# EAGLE design BATT_INPUT_REVISION (EAGLE 9.6.2)
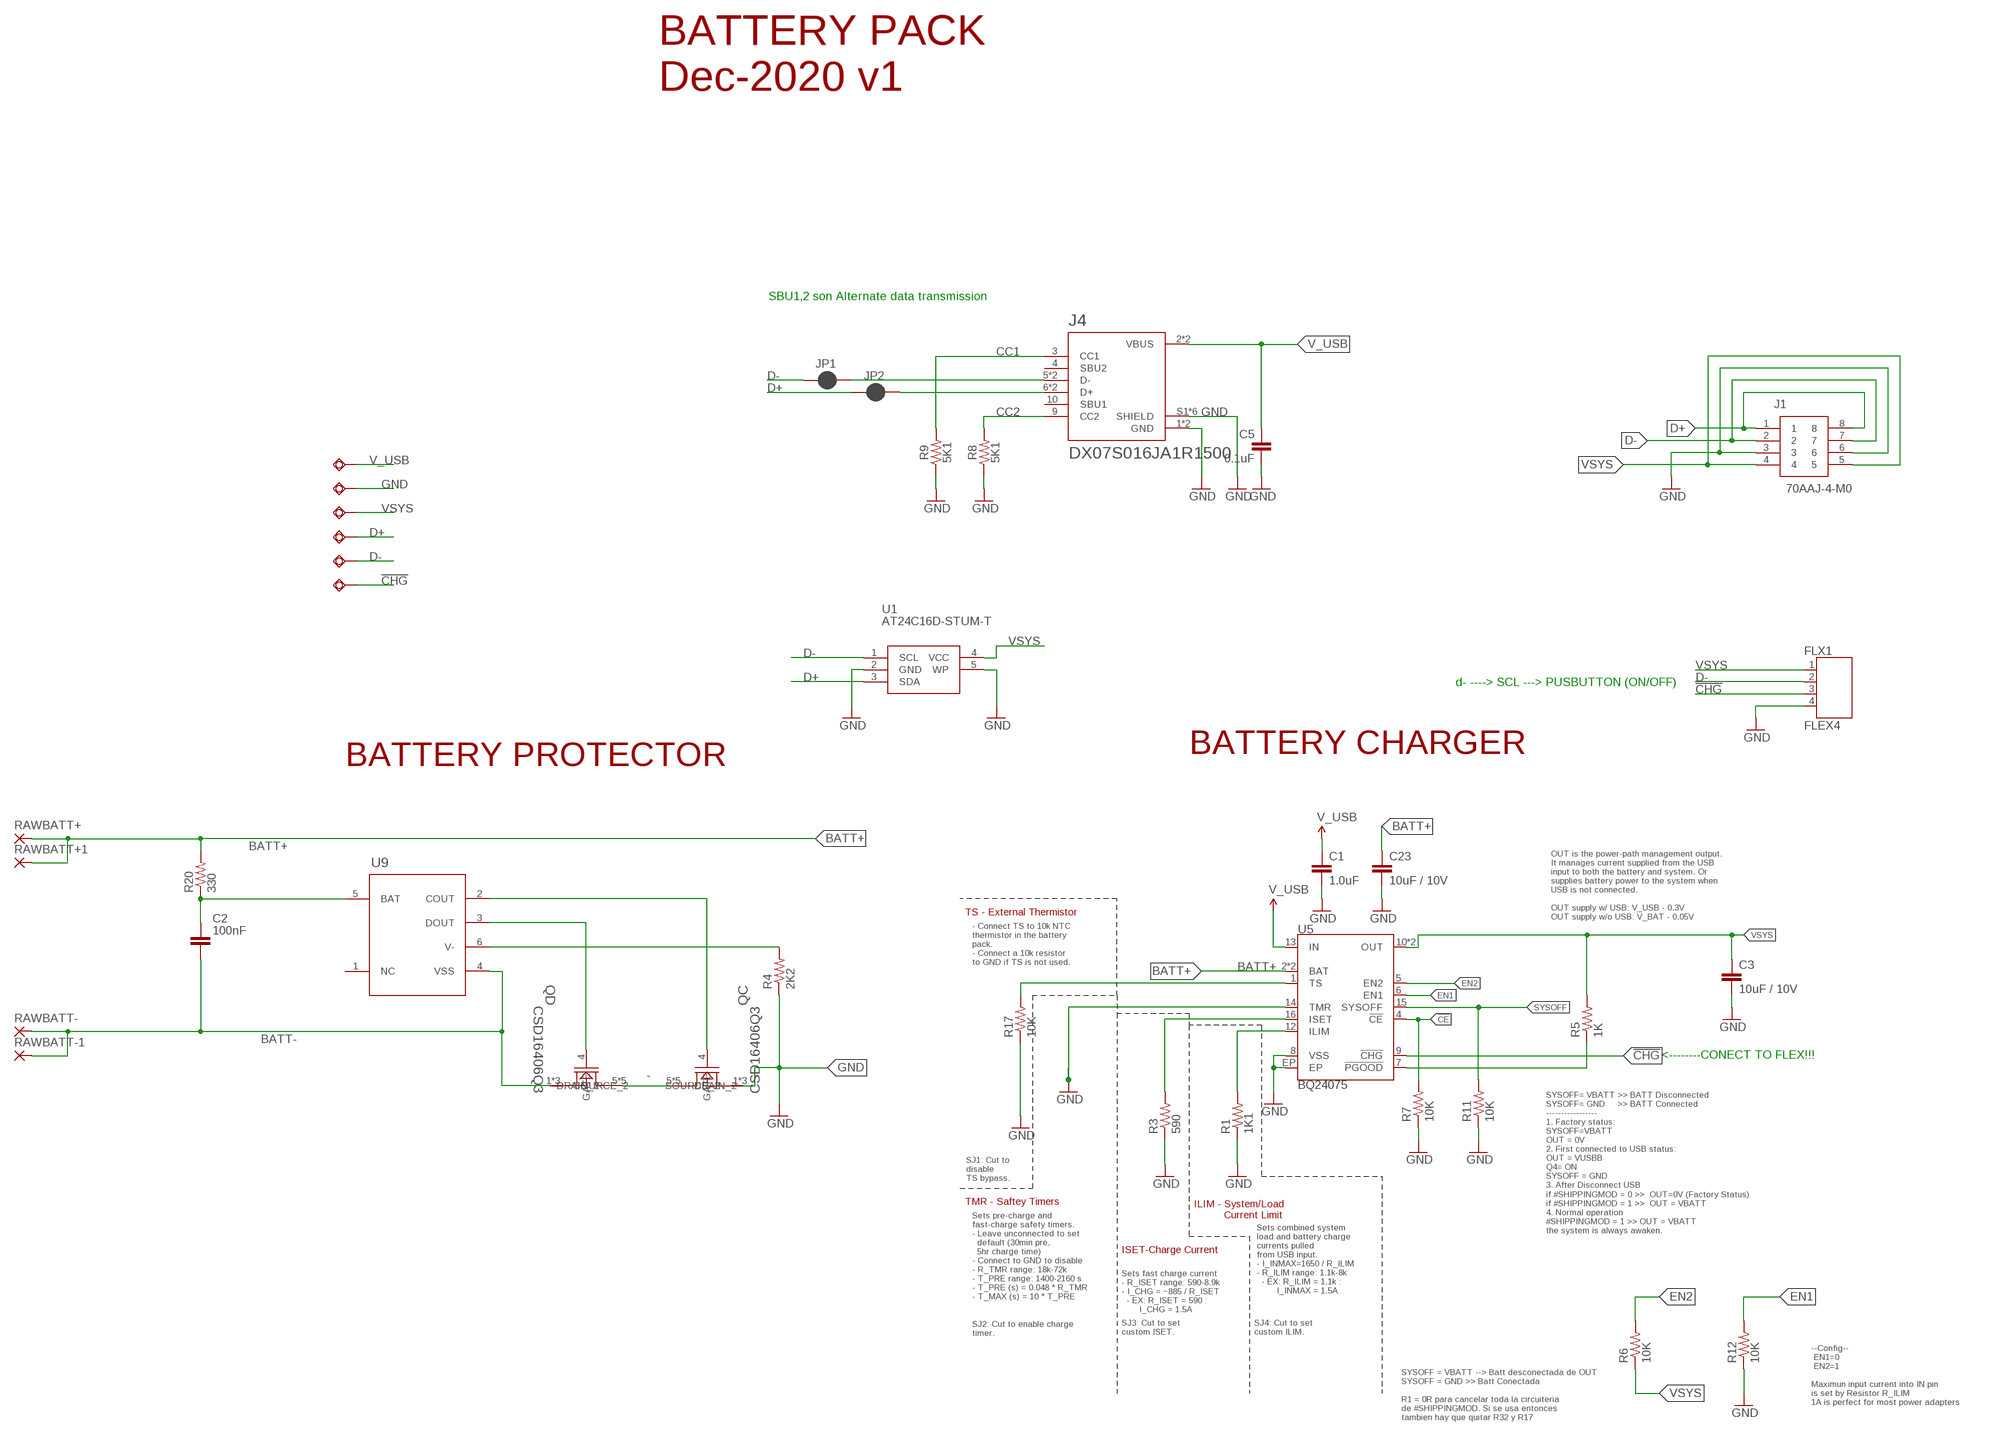
[diagram p0: schematic, sheet 1]

## Parts
!CHG!  TESTPAD_TPSQB1,27  [TESTPAD_B1,27]
C1  1.0uF  1.0UF-0603-16V-10%  [0603]
C2  100nF  C_CHIP-0603(1608-METRIC)  [CAPC1608X85]
C3  10uF / 10V  10UF10V10%(0805)  [0805-CAP]
C5  0.1uF  0.1UF-0603-25V-(+80/-20%)  [0603]
C23  10uF / 10V  10UF10V10%(0805)  [0805-CAP]
D+  TESTPAD_TPSQB1,27  [TESTPAD_B1,27]
D-  TESTPAD_TPSQB1,27  [TESTPAD_B1,27]
FLX1  FLEX4  [FLEX4]
GND  TESTPAD_TPSQB1,27  [TESTPAD_B1,27]
J1  70AAJ-4-M0  [70AAJ4M0]
J4  DX07S016JA1R1500  [JAE_DX07S016JA1R1500]
JP1  JUMPER-SMT_2_NC_PASTE_SILK  [SMT-JUMPER_2_NC_PASTE_SILK]
JP2  JUMPER-SMT_2_NC_PASTE_SILK  [SMT-JUMPER_2_NC_PASTE_SILK]
QC  CSD16406Q3  [DQG0008A]
QD  CSD16406Q3  [DQG0008A]
R1  1K1  RESISTOR0402  [0402]
R3  590  RESISTOR0402  [0402]
R4  2K2  RESISTOR0402  [0402]
R5  1K  RESISTOR0402  [0402]
R6  10K  RESISTOR0402  [0402]
R7  10K  RESISTOR0402  [0402]
R8  5K1  RESISTOR0402  [0402]
R9  5K1  RESISTOR0402  [0402]
R11  10K  RESISTOR0402  [0402]
R12  10K  RESISTOR0402  [0402]
R17  10K  RESISTOR0402  [0402]
R20  330  RESISTOR0402  [0402]
RAWBATT+  SMD5  [SMD2,54-5,08]
RAWBATT+1  SMD5  [SMD2,54-5,08]
RAWBATT-  SMD5  [SMD2,54-5,08]
RAWBATT-1  SMD5  [SMD2,54-5,08]
U1  AT24C16D-STUM-T  [SOT95P280X100-5N]
U5  BQ24075  [PVQFN-N16]
U9  Value  BQ29700DSER  [DSE0006A]
V_USB  TESTPAD_TPSQB1,27  [TESTPAD_B1,27]
VSYS  TESTPAD_TPSQB1,27  [TESTPAD_B1,27]

## Nets
!CE!: R7.2 U5.4(!CE!)
!CHG!: !CHG!.TP FLX1.3 U5.9(!CHG!)
-: QC.5(DRAIN_2) QC.6(DRAIN_2) QC.7(DRAIN_2) QC.8(DRAIN_2) QC.9(DRAIN_2) QD.5(DRAIN_2) QD.6(DRAIN_2) QD.7(DRAIN_2) QD.8(DRAIN_2) QD.9(DRAIN_2)
BATT+: C23.1 R20.2 RAWBATT+1.1(P) RAWBATT+.1(P) U5.2(BAT) U5.3(BAT)
BATT-: C2.2 QD.1(SOURCE_2) QD.2(SOURCE_2) QD.3(SOURCE_2) RAWBATT-1.1(P) RAWBATT-.1(P) U9.4(VSS)
CC1: J4.3(CC1) R9.2
CC2: J4.9(CC2) R8.2
D+: D+.TP J1.1 J1.8 JP2.1 U1.3(SDA)
D-: D-.TP FLX1.2 J1.2 J1.7 JP1.1 U1.1(SCL)
EN1: R12.2 U5.6(EN1)
EN2: R6.2 U5.5(EN2)
GND: C1.2 C3.2 C5.2 C23.2 FLX1.4 GND.TP J1.3 J1.6 J4.1(GND) J4.12(GND) J4.S1(SHIELD) J4.S2(SHIELD) J4.S3(SHIELD) J4.S4(SHIELD) J4.S5(SHIELD) J4.S6(SHIELD) QC.1(SOURCE_2) QC.2(SOURCE_2) QC.3(SOURCE_2) R1.1 R3.1 R4.1 R7.1 R8.1 R9.1 R11.1 R12.1 R17.1 U1.2(GND) U1.5(WP) U5.8(VSS) U5.14(TMR) U5.EP
ILIM: R1.2 U5.12(ILIM)
ISET: R3.2 U5.16(ISET)
N$1: R5.1 U5.7(!PGOOD!)
N$2: J4.5(D-) J4.8(D-) JP1.2
N$3: J4.6(D+) J4.7(D+) JP2.2
N$12: C2.1 R20.1 U9.5(BAT)
N$20: R4.2 U9.6(V-)
N$25: QC.4(GATE) U9.2(COUT)
N$26: QD.4(GATE) U9.3(DOUT)
SYSOFF: R11.2 U5.15(SYSOFF)
TS1: R17.2 U5.1(TS)
V_USB: C1.1 C5.1 J4.2(VBUS) J4.11(VBUS) U5.13(IN) V_USB.TP
VSYS: C3.1 FLX1.1 J1.4 J1.5 R5.2 R6.1 U1.4(VCC) U5.10(OUT) U5.11(OUT) VSYS.TP
Unconnected: J4.4(SBU2) J4.10(SBU1) U9.1(NC)

## Notes on the sheet
- BATTERY PACK
  Dec-2020 v1
- SBU1,2 son Alternate data transmission
- d- ----> SCL ---> PUSBUTTON (ON/OFF)
- BATTERY CHARGER
- BATTERY PROTECTOR
- OUT is the power-path management output.
  It manages current supplied from the USB 
  input to both the battery and system. Or
  supplies battery power to the system when 
  USB is not connected.
  
  OUT supply w/ USB: V_USB - 0.3V
  OUT supply w/o USB: V_BAT - 0.05V
- TS - External Thermistor
- - Connect TS to 10k NTC 
  thermistor in the battery
  pack.
  - Connect a 10k resistor 
  to GND if TS is not used.
- <--------CONECT TO FLEX!!!
- SYSOFF= VBATT >> BATT Disconnected
  SYSOFF= GND     >> BATT Connected
  -----------------
  1. Factory status:
  SYSOFF=VBATT
  OUT = 0V
  2. First connected to USB status:
  OUT = VUSBB
  Q4= ON
  SYSOFF = GND
  3. After Disconnect USB
  if #SHIPPINGMOD = 0 >>  OUT=0V (Factory Status)
  if #SHIPPINGMOD = 1 >>  OUT = VBATT
  4. Normal operation
  #SHIPPINGMOD = 1 >> OUT = VBATT 
  the system is always awaken.
- SJ1: Cut to 
  disable
  TS bypass.
- TMR - Saftey Timers
- ILIM - System/Load 
            Current Limit
- Sets pre-charge and
  fast-charge safety timers.
  - Leave unconnected to set
    default (30min pre, 
    5hr charge time)
  - Connect to GND to disable
  - R_TMR range: 18k-72k
  - T_PRE range: 1400-2160 s
  - T_PRE (s) = 0.048 * R_TMR
  - T_MAX (s) = 10 * T_PRE
- Sets combined system
  load and battery charge 
  currents pulled
  from USB input.
  - I_INMAX=1650 / R_ILIM
  - R_ILIM range: 1.1k-8k
    - EX: R_ILIM = 1.1k : 
          I_INMAX = 1.5A
- ISET-Charge Current
- Sets fast charge current
  - R_ISET range: 590-8.9k
  - I_CHG = ~885 / R_ISET
    - EX: R_ISET = 590 : 
         I_CHG = 1.5A
- SJ3: Cut to set
  custom ISET.
- SJ4: Cut to set
  custom ILIM.
- SJ2: Cut to enable charge
  timer.
- --Config--
   EN1=0 
   EN2=1
  
  Maximun input current into IN pin
  is set by Resistor R_ILIM
  1A is perfect for most power adapters
- SYSOFF = VBATT --> Batt desconectada de OUT
  SYSOFF = GND >> Batt Conectada
  
  R1 = 0R para cancelar toda la circuiteria
  de #SHIPPINGMOD. Si se usa entonces
  tambien hay que quitar R32 y R17

## Library data of the parts
!CHG! D+ D- GND V_USB VSYS = BeagleBone_Blue_R3:TESTPAD_TPSQ: Test pad
C1 = SparkFun-Capacitors:1.0UF: 1µF ceramic capacitors A capacitor is a passive two-terminal electrical component used to store electrical energy temporarily in an electric field.; PROD_ID: CAP-00868
C2 = Tutorial - Fusion 360:C: Capacitor - Generic; CATEGORY: Capacitor
C3 C23 = SparkFun-Capacitors:10UF10V10%(0805): CAP-11330; PROD_ID: CAP-11330
C5 = SparkFun-Capacitors:0.1UF: 0.1µF ceramic capacitors A capacitor is a passive two-terminal electrical component used to store electrical energy temporarily in an electric field.; PROD_ID: CAP-00810
FLX1 = Flex4:FLEX4
J1 = ANTENNA:70AAJ-4-M0: Bourns Male 4 Way Modular Contact, Surface Mount, 3A, 60 V Source: Datasheet <https://componentsearchengine.com/Datasheets/1/70AAJ-4-M0.pdf>; DESCRIPTION: Bourns Male 4 Way Modular Contact, Surface Mount, 3A, 60 V; HEIGHT: 3.81mm; MANUFACTURER_NAME: Bourns; MANUFACTURER_PART_NUMBER: 70AAJ-4-M0; MOUSER_PART_NUMBER: 652-70AAJ-4-M0; MOUSER_PRICE-STOCK: https://www.mouser.com/Search/Refine.aspx?Keyword=652-70AAJ-4-M0
J4 = DX07S016JA1R1500:DX07S016JA1R1500: USB-C (USB TYPE-C) USB 2.0 Receptacle Connector 24 (16+8 Dummy) Position Surface Mount, Right Angle; Through Hole; DESCRIPTION: USB-C (USB TYPE-C) USB 2.0 Receptacle Connector 24 (16+8 Dummy) Position Surface Mount, Right Angle; Through Hole; DIGI-KEY_PART_NUMBER: 670-DX07S016JA1R1500CT-ND; MF: JAE Electronics; MP: DX07S016JA1R1500; PACKAGE: None; PURCHASE-URL: https://pricing.snapeda.com/search/part/DX07S016JA1R1500/?ref=eda
JP1 JP2 = SparkFun-Jumpers:JUMPER-SMT_2_NC_PASTE: Normally closed solder jumper This jumper has an aperture in the stencil to allow solder paste to bridge the split in the wire so it's normally closed (NC). Wick off the solder to open the connection. Reapply solder to reclose the connection.
QC QD = CSD16406Q3:CSD16406Q3; DATASHEET_URL: http://www.ti.com/lit/ds/symlink/csd16406q3.pdf; IDSMAX: 60.0; MANUFACTURER_PART_NUMBER: CSD16406Q3; QGTYP: 5.8; QUANTITY: 1; RDSON45: 0.0059; VDSMAX: 25.0; VENDOR: Texas Instruments
R1 R3-R9 R11 R12 R17 R20 = SparkFun-Resistors:RESISTOR: Generic Resistor Package
RAWBATT+ RAWBATT+1 RAWBATT- RAWBATT-1 = wirepad:SMD5: SMD PAD
U1 = AT24C16D-STUM-T:AT24C16D-STUM-T: EEPROM Serial-2Wire 16K-bit 2K x 8 1.8V/2.5V/3.3V 5-Pin SOT-23 T/R Source: Datasheet <https://www.arrow.com/en/products/at24c16d-stum-t/microchip-technology>; ARROW_PART_NUMBER: AT24C16D-STUM-T; ARROW_PRICE-STOCK: https://www.arrow.com/en/products/at24c16d-stum-t/microchip-technology; DESCRIPTION: EEPROM Serial-2Wire 16K-bit 2K x 8 1.8V/2.5V/3.3V 5-Pin SOT-23 T/R; HEIGHT: 1mm; MANUFACTURER_NAME: Microchip; MANUFACTURER_PART_NUMBER: AT24C16D-STUM-T; MOUSER_PART_NUMBER: 556-AT24C16D-STUM-T; MOUSER_PRICE-STOCK: https://www.mouser.co.uk/ProductDetail/Microchip-Technology-Atmel/AT24C16D-STUM-T?qs=YAvGbpKWXiSFXLERVL65hQ%3D%3D
U5 = battery-management-temp:BQ24075; PROD_ID: IC-13219
U9 = BQ2970:BQ29700DSER; MANUFACTURER: Texas Instruments; PARTNUMBER: BQ29705DSER; REFDES: RefDes; TYPE: TYPE

## Net classes
1 power: width 0.178 mm
2 gnd: width 0.305 mm, drill 0.483 mm, clearance 0.203 mm

## Board
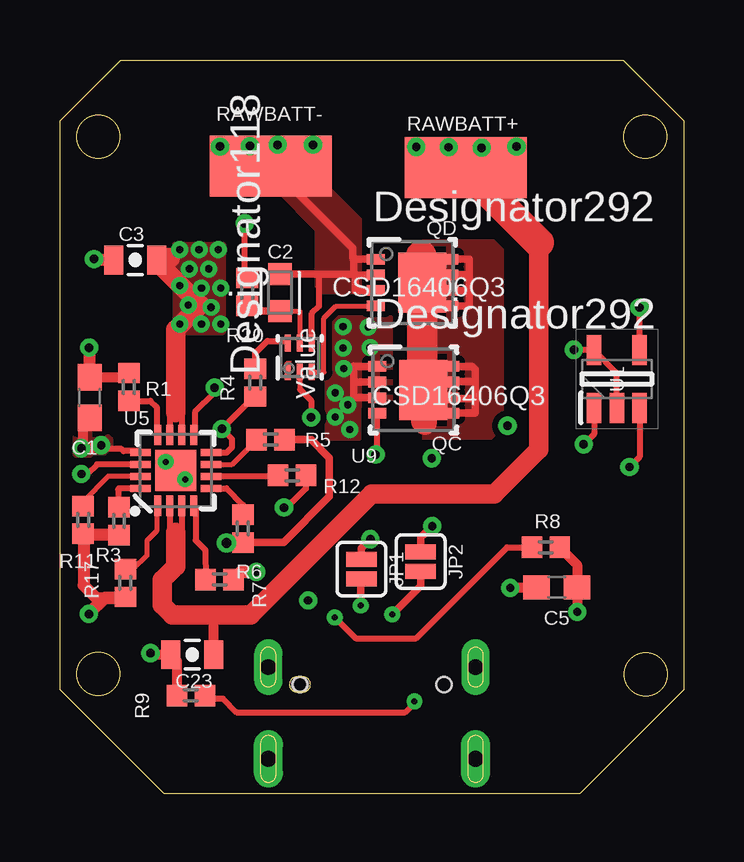
[diagram p1: board, top side]
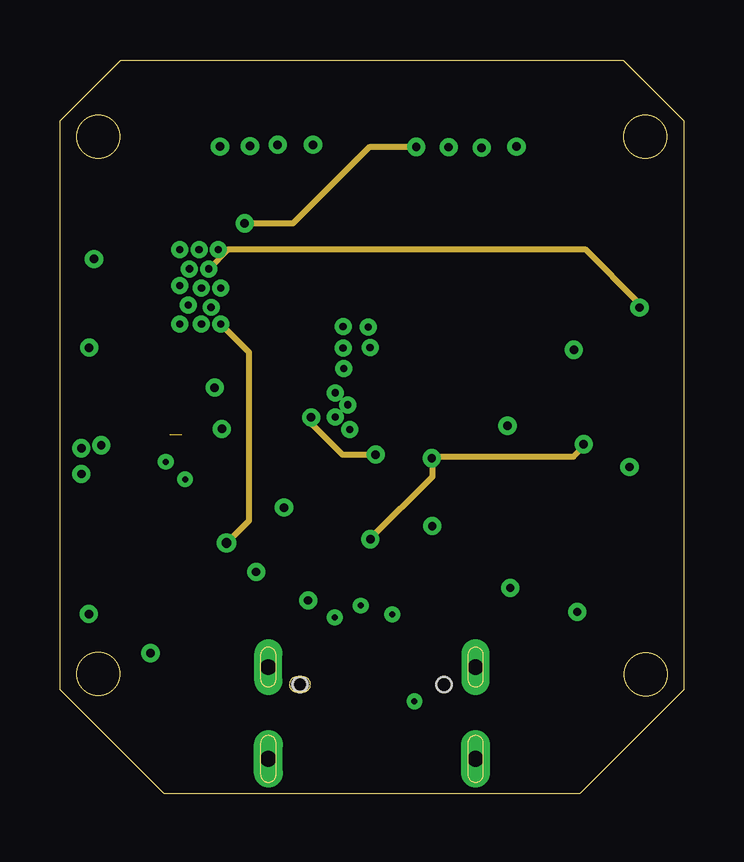
[diagram p2: board, inner layer Route2]
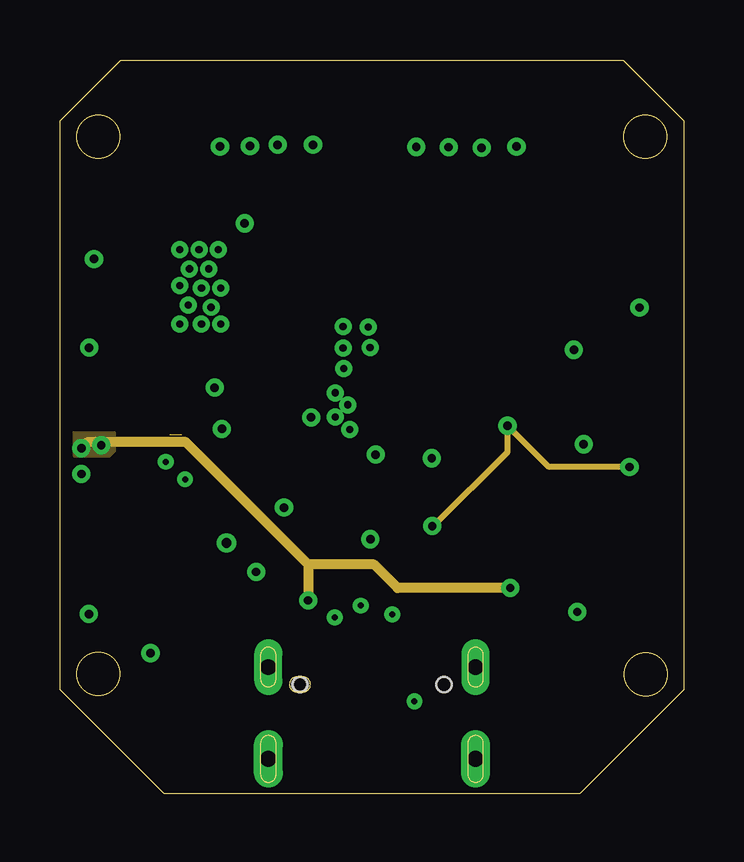
[diagram p3: board, inner layer Route15]
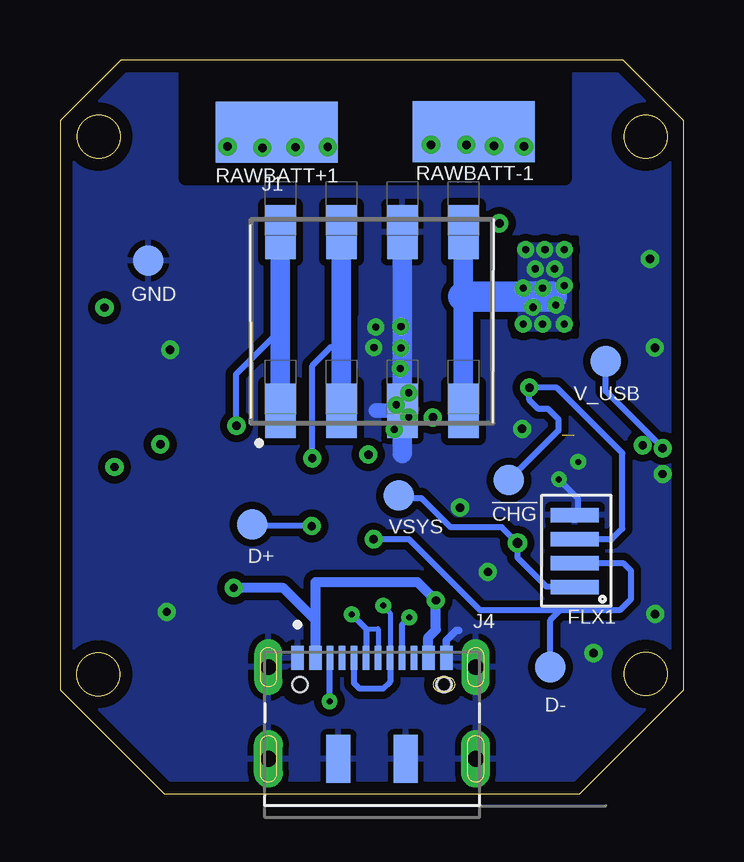
[diagram p4: board, bottom side, seen from below]

Size 26 x 30.6 mm. Coordinates in mm from the lower left corner, seen from the top.
Outline: 26,4.35 21.65,0 4.35,0 0,4.35 0,28.06 2.54,30.6 23.46,30.6 26,28.06 26,4.35
Outline: circle at 1.6,5 radius 0.9
Outline: circle at 1.59,27.41 radius 0.9
Outline: circle at 24.39,27.41 radius 0.9
Outline: circle at 24.4,4.99 radius 0.9
Copper layers (1+2*15+16): Top 0.035mm / dielectric 1.5mm / Route2 0.035mm / dielectric 0.15mm / Route15 0.035mm / dielectric 0.2mm / Bottom 0.035mm
Design rules "default *": minimum track width 6mil, minimum drill 0.2mm, track to track 10mil, track to pad 10mil, pad to pad 10mil, via to via 10mil, smd to smd 6mil, copper to edge 20mil, drill to drill 6mil, minimum pad ring 10mil, minimum via ring 8mil, stop-mask expansion 4mil, vias tented up to drill 0mil, thermal gap 10mil
bRestrict: area 5,25.7 to 20.8,30.3

### Footprints (pad centres in the part's own frame; a part is rotated, then mirrored left to right if it is on the bottom)
TESTPAD_B1,27 = smd 1.27 x 1.27: TP 0,0
0603 = smd 1.1 x 1: 1 -0.85,0; 2 0.85,0
CAPC1608X85 = smd 0.921 x 0.97: 1 -0.775,0; 2 0.775,0
0805-CAP = smd 0.8 x 1.2: 1 -0.9,0; 2 0.9,0
FLEX4 = smd 0.6 x 2: 1 -3.77,1.52; 2 -2.77,1.52; 3 -1.77,1.52; 4 -0.77,1.52
70AAJ4M0 = smd 1.27 x 2.26: 1 -3.81,-3.72; 2 -1.27,-3.72; 3 1.27,-3.72; 4 3.81,-3.72; 5 3.81,3.72; 6 1.27,3.72; 7 -1.27,3.72; 8 -3.81,3.72
JAE_DX07S016JA1R1500 = smd 0.52 x 1: 1 -3.1,1.1; 2 -2.35,1.1; 11 2.35,1.1; 12 3.1,1.1 | smd 0.27 x 1: 3 -1.75,1.1; 4 -1.25,1.1; 5 -0.75,1.1; 6 -0.25,1.1; 7 0.25,1.1; 8 0.75,1.1; 9 1.25,1.1; 10 1.75,1.1 | smd 1 x 2: S1 -1.4,-3.1; S2 1.4,-3.1 | drill 0.65 long: S3 -4.32,0.725; S4 4.32,0.725 | drill 0.65 pad 1.2 long: S5 -4.32,-3.1; S6 4.32,-3.1 | hole 0.6: 3,0 | hole 0.63: 3,0; -3,0
SMT-JUMPER_2_NC_PASTE_SILK = smd 0.635 x 1.27: 1 -0.406,0; 2 0.406,0
DQG0008A = smd 0.75 x 0.44: 1 -1.525,0.975; 2 -1.525,0.325; 3 -1.525,-0.325; 4 -1.525,-0.975; 5 1.525,-0.975; 6 1.525,-0.325; 7 1.525,0.325; 8 1.525,0.975 | smd 2 x 2.5: 9 0.4,0 | smd 0.5 x 0.5: V 0.226,0.975
0402 = smd 0.85 x 0.9: 1 -0.58,0; 2 0.58,0
SMD2,54-5,08 = smd 2.54 x 5.08: 1 0,0
SOT95P280X100-5N = smd 1.25 x 0.6: 1 -1.2,0.95; 2 -1.2,0; 3 -1.2,-0.95; 4 1.2,-0.95; 5 1.2,0.95
PVQFN-N16 = smd 0.28 x 0.85: 1 -0.75,-1.475; 2 -0.25,-1.475; 3 0.25,-1.475; 4 0.75,-1.475; 9 0.75,1.475; 10 0.25,1.475; 11 -0.25,1.475; 12 -0.75,1.475 | smd 0.85 x 0.28: 5 1.475,-0.75; 6 1.475,-0.25; 7 1.475,0.25; 8 1.475,0.75; 13 -1.475,0.75; 14 -1.475,0.25; 15 -1.475,-0.25; 16 -1.475,-0.75 | smd 1.7 x 1.7: EP 0,0
DSE0006A = smd 0.66 x 0.25: 1 -0.62,0.5 | smd 0.7 x 0.25: 2 -0.6,0; 3 -0.6,-0.5; 4 0.6,-0.5; 5 0.6,0; 6 0.6,0.5

### Placement (x,y rotation side)
!CHG!  7.29,13.09 0 bottom
C1  1.23,16.53 90 top
C2  9.16,20.9 90 top
C3  3.13,22.26 180 top
C5  20.7,8.61 0 top
C23  5.51,5.81 180 top
D+  17.99,11.24 0 bottom
D-  5.57,5.29 0 bottom
FLX1  3.03,12.4 90 bottom
GND  22.32,22.24 0 bottom
J1  13,19.7 0 bottom
J4  13,4.56 0 bottom
JP1  12.56,9.37 270 top
JP2  15.03,9.69 270 top
QC  14.73,16.85 0 top
QD  14.68,21.32 0 top
R1  2.87,16.97 270 top
R3  2.46,11.37 90 top
R4  8.13,17.15 90 top
R5  8.77,14.77 0 top
R6  7.62,11.06 90 top
R7  6.65,8.94 180 top
R8  20.24,10.28 180 top
R9  5.45,4.11 0 top
R11  0.96,11.42 90 top
R12  9.67,13.28 180 top
R17  2.73,8.79 90 top
R20  7.8,20.93 90 top
RAWBATT+  16.9,26.11 90 top
RAWBATT+1  16.97,27.59 270 bottom
RAWBATT-  8.77,26.17 90 top
RAWBATT-1  8.77,27.61 270 bottom
U1  23.2,17.3 90 top
U5  4.82,13.49 0 top
U9  9.99,18.2 90 top
V_USB  3.27,18.04 0 bottom
VSYS  11.89,12.44 0 bottom

### Tracks (layer width: path | path; a pad name or v marks a point on that pad's centre or on a via)
!CE!
  Top 0.254: U5.4 5.65,11.94 5.65,10.58 6.06,10.17 R7.2
!CHG!  (via drill 0.35)
  Top 0.254: U5.9 5.62,15.01 5.62,15.91 6.44,16.73 v6.44,16.94
  Bottom 0.254: FLX1.3 3,10.63 2.57,11.06 2.57,14.21 5.29,16.94 v6.44,16.94 6.44,16.41 6.09,16.06 5.67,16.06 5.24,15.63 5.24,15.15 !CHG!.TP
-
  Top 0.254: 17.19,17.79 17.16,17.82
  Top 0.305: QD.8 17.04,22.29 17.04,21.64 | 17.04,21.64 17.04,21.04 | 17.04,21.04 17.04,20.34 QD.5 | QD.6 17,20.99 17.04,21.04 | QD.7 17.04,21.64 | QC.5 17.28,15.87 17.29,15.89 17.29,16.49 16.29,16.49 QC.6 | 17.29,16.59 17.29,17.19 | 17.29,17.19 17.29,17.69 17.19,17.79 | 17.16,17.82 QC.8 | QC.7 16.27,17.19 17.29,17.19
  Top 1.016: QC.9 15.13,15.55 15.19,15.49
  Top 1.27: 15.04,22.44 15.04,21.36 QD.9 15.08,19.75 15.09,19.74 15.08,19.73 15.08,16.9 QC.9
  pour Top (isolate 0.254): 15.09,23.09 15.09,14.79 17.99,14.79 18.49,15.29 18.49,22.69 18.09,23.09
BATT+  (via drill 0.35)
  Top 0.203: RAWBATT+.1 16.9,26.27 v17.57,26.94
  Top 0.254: RAWBATT+.1 15.97,26.11 15.1,26.98 v14.84,26.98 | R20.2 7.69,21.85 v7.69,23.79 | U5.2 4.57,10.91 4.82,10.91 5.04,10.91 5.07,10.94 U5.3
  Top 0.406: C23.1 6.41,7.2 6.67,7.47
  Top 0.813: 4.82,10.91 4.82,9.48 4.25,8.92 4.25,7.89 4.68,7.47 6.67,7.47 7.95,7.47 12.99,12.51 18.08,12.51 19.94,14.37 19.94,22.99
  Top 1.27: RAWBATT+.1 16.9,26.03 19.94,22.99
  Route2 0.254: v7.69,23.79 9.72,23.79 12.91,26.98 v14.84,26.98
  Bottom 0.305: RAWBATT+1.1 16.34,26.96 v16.19,26.96 | RAWBATT+1.1 16.97,27.54 v17.57,26.94 | RAWBATT+1.1 17.57,26.99 v19.02,26.99
BATT-  (via drill 0.35)
  Top 0.203: v7.92,27.01 RAWBATT-.1 7.49,26.17 v6.67,26.99
  Top 0.254: U9.4 10.49,20.04 10.79,20.34 10.79,21.67
  Top 0.305: RAWBATT-.1 12.19,22.75 12.19,22.34 12.24,22.29 | 12.24,22.29 QD.1 | QD.2 13.14,21.62 12.29,21.62 12.29,20.99 12.3,20.99 QD.3 | 12.26,21.67 12.24,21.69 12.24,22.29 | C2.2 10.79,21.67 12.26,21.67 | 12.26,21.67 12.29,21.64
  Bottom 0.305: RAWBATT-1.1 9.32,27.06 v10.54,27.06 | RAWBATT-1.1 8.77,27.36 v9.07,27.06 | RAWBATT-1.1 8.17,27.01 v7.92,27.01
  pour Top (no thermals): 10.84,25.69 12.54,23.99 12.54,20.84 10.94,20.84 10.74,21.04 10.64,21.14 10.64,23.49 9.04,25.09 9.04,25.69
CC1  (via drill 0.25)
  Top 0.254: R9.2 6.17,3.97 6.79,3.97 7.35,3.41 14.39,3.41 14.77,3.79 v14.77,3.86
  Bottom 0.254: v14.77,3.86 14.77,5.64 J4.3
CC2  (via drill 0.25)
  Top 0.254: R8.2 18.63,10.28 14.83,6.49 12.32,6.49 v11.44,7.36
  Bottom 0.254: J4.9 11.75,6.53 11.74,6.54 11.74,7.06 v11.44,7.36
D+  (via drill 0.35)
  Top 0.254: U1.3 24.15,14.05 v23.73,13.63
  Top 0.305: JP2.1 15.03,10.69 v15.5,11.17 v15.51,11.17
  Route15 0.254: v15.51,11.17 15.56,11.17 18.65,14.26 v18.65,15.35 18.7,15.3 20.37,13.63 v23.73,13.63
  Bottom 0.254: v18.65,15.35 18.67,15.37 18.67,17.49 16.81,19.35 | v15.51,11.17 17.92,11.17
  Bottom 0.305: 17.92,11.17 D+.TP
  Bottom 0.813: J1.8 16.81,19.35 J1.1
D-  (via drill 0.35)
  Top 0.254: U1.1 22.25,15 v21.83,14.57 v21.82,14.58
  Top 0.305: v12.93,10.62 12.56,10.24 JP1.1
  Route2 0.254: v12.93,10.62 12.93,10.64 15.51,13.22 15.51,13.97 v15.49,13.99 15.56,14.07 21.39,14.07 21.82,14.49 v21.82,14.58
  Bottom 0.254: v15.49,13.99 15.49,17.85 14.69,18.65 14.27,18.65 | FLX1.2 2.53,9.63 2.22,9.31 2.22,8.12 2.68,7.65 5.17,7.65 | 5.17,7.65 8.48,7.65 11.45,10.62 v12.93,10.62 | D-.TP 5.57,7.25 5.17,7.65
  Bottom 0.813: J1.7 14.27,18.65 J1.2
EN1
  Top 0.254: R12.2 8.81,13.24 U5.6
EN2
  Top 0.254: U5.5 6.94,12.74 7.62,12.05 R6.2
GND  (via drill 0.25, 0.3, 0.3 pad 0.6, 0.35)
  Top 0.254: U5.8 6.94,14.24 6.94,14.23 7.17,14.46 7.17,14.79 v6.74,15.22 8.09,16.57 R4.1 | 2.7,17.38 R1.1 | R12.1 10.25,12.73 9.45,11.94 v9.33,11.94 | U1.2 23.18,16.12 23.18,17.57 U1.5 21.53,18.5 21.52,18.49 21.44,18.49 v21.41,18.52 | v0.89,13.34 1.14,13.34 1.54,13.74 U5.14 | U5.EP 4.76,13.49 v4.4,13.85
  Top 0.305: QC.1 12.26,17.82 | 12.26,17.82 12.24,17.84 | 12.26,17.82 12.24,17.81 12.24,17.24 | 12.24,17.24 12.24,16.54 12.26,16.52 QC.3 | QC.2 12.31,17.17 12.24,17.24 | 1.02,8.67 0.98,8.71
  Top 0.406: C1.2 2.7,17.38 | R8.1 21.55,9.56 C5.2 21.55,7.61 v21.56,7.6 v21.55,7.59 | R9.1 4.87,5.54 C23.2 3.88,5.81 3.82,5.87 v3.77,5.87
  Top 0.508: C3.2 1.39,22.26 1.38,22.27 v1.42,22.3 | C1.2 1.23,18.51 1.24,18.52 1.24,18.58 v1.21,18.61 | R3.1 1.01,10.79 R11.1 0.98,10.83 0.98,8.71 | 1.02,8.67 1.53,8.15 2.67,8.15 R17.1 2.69,8.18 1.88,8.18 v1.2,7.5 | R7.1 7.55,9.26 v8.17,9.26
  Bottom 0.254: v5.21,13.12 4.42,12.33 4.42,11.76 FLX1.4
  Bottom 0.305: J4.12 9.9,6.41 9.49,6.81 9.39,6.81
  Bottom 0.508: 12.85,15.98 12.87,15.96
  Bottom 0.61: J1.3 12.85,15.98
  Bottom 0.813: J1.6 J1.3 11.73,14.2
  other vias: 11.79,19.49 12.84,19.46 12.92,18.61 11.46,16.72 11.99,16.22 11.79,18.59 11.47,15.71 12.07,15.19 11.82,17.74
  pour Bottom (isolate 0.305, rank 3): -0.37,31.55 -0.37,-0.22 26.42,-0.22 26.42,28.43 23.3,31.55
  pour Top (isolate 0.254): 11.09,19.89 11.09,14.79 12.49,14.79 12.49,16.19 13.79,16.19 13.79,19.89
  pour Bottom: 11.09,19.89 11.09,14.89 12.09,14.89 12.09,17.77 13.55,17.77 13.55,19.89
ILIM
  Top 0.254: U5.12 4.02,15.01 4.02,16.13 3.77,16.39 R1.2
ISET
  Top 0.254: U5.16 2.47,12.74 2.42,12.69 2.42,11.99 R3.2
N$1
  Top 0.203: U5.7 7.17,13.74 8.13,14.7
  Top 0.254: 8.13,14.7 R5.1
N$2  (via drill 0.25)
  Top 0.305: JP1.2 12.53,8.94 v12.53,7.85
  Bottom 0.203: 12.53,7.83 12.24,7.54 J4.8
  Bottom 0.254: v12.53,7.85 12.53,7.83 | J4.8 12.25,4.68 12.54,4.39 13.52,4.39 13.75,4.62 J4.5
N$3  (via drill 0.25)
  Top 0.305: JP2.2 15.03,8.67 14.19,7.84 v13.84,7.49
  Bottom 0.203: 13.24,6.89 12.74,6.89 J4.7
  Bottom 0.254: v13.84,7.49 13.24,6.89 J4.6 | J4.7
N$12
  Top 0.203: C2.1 9.99,20.12 U9.5
  Top 0.305: R20.1 7.81,20.12 C2.1
N$20
  Top 0.254: U9.6 9.4,18.89 8.64,18.89 8.13,18.38 R4.2
N$25  (via drill 0.35)
  Top 0.203: U9.2 9.99,16.88
  Top 0.254: 9.99,16.88 10.46,16.41 v10.46,15.7 | v13.15,14.15 13.21,14.2 QC.4
  Route2 0.254: v10.46,15.7 10.46,15.45 11.76,14.15 v13.15,14.15
N$26
  Top 0.203: U9.3 10.99,17.59 10.99,19.84 11.49,20.34 QD.4
  Top 0.254: U9.3 | QD.4
SYSOFF
  Top 0.203: U5.15 2,13.24 0.96,12.2 R11.2
TS1
  Top 0.203: U5.1 4.02,11.96 4.02,10.96 3.62,10.56 3.62,9.93 3.06,9.37 R17.2
V_USB  (via drill 0.35)
  Top 0.254: U5.13 3.3,14.29 2.65,14.29 2.55,14.39 1.34,14.39 1.32,14.41
  Top 0.305: 1.32,14.41 0.95,14.41
  Top 0.406: C1.1 0.95,15.4 0.95,14.41 | v18.76,8.59 19.82,8.59 C5.1 | v0.89,14.41 1.32,14.41
  Route15 0.406: v0.89,14.41 1.14,14.66 5.24,14.66 10.34,9.57 | 10.34,9.57 v10.34,8.07 | v18.76,8.59 14.07,8.59 13.09,9.57 10.34,9.57
  Bottom 0.254: v0.89,14.41 3.27,16.79 V_USB.TP
  Bottom 0.406: J4.2 15.35,7.24 | v18.76,8.59 16.69,8.59 15.35,7.24 | J4.11 10.65,6.53 10.34,6.84 v10.34,8.07 11.11,8.84 15.35,8.84 15.35,7.24
  other vias: 1.72,14.54
  pour Top (isolate 0.254): 0.42,15.21 0.42,14.26 0.62,14.06 1.29,14.06 1.39,14.16 1.89,14.16 2.19,14.46 2.19,14.79 2.09,14.89 2.04,14.94 1.47,14.94 1.34,15.06 1.34,15.26 0.44,15.26 0.42,15.24
  pour Route15: 0.47,15.04 0.47,14.19 0.59,14.06 2.07,14.06 2.29,14.29 2.29,15.06 0.47,15.06
VSYS  (via drill 0.3 pad 0.6, 0.35, 0.4)  (1 unrouted)
  Top 0.254: 4.57,15.91 U5.11 | U5.10 5.07,15.91 4.82,15.91 | U1.4 v24.15,20.27 v24.14,20.28 | R6.1 6.94,10.48 v6.94,10.46
  Top 0.305: R5.2 10.47,14.77 11.23,14.01 11.23,12.39 9.32,10.48 R6.1
  Top 0.813: 4.6,22.34 4.57,22.37 4.24,22.37 4.19,22.41 C3.1 4.03,22.2 5.84,20.39 4.82,19.37 4.82,15.91
  Route2 0.254: v6.19,21.89 7.01,22.71 21.88,22.71 24.14,20.45 v24.14,20.28 | v6.69,19.59 7.87,18.41 7.87,11.39 v6.94,10.46
  Bottom 0.254: FLX1.1 4.57,8.65 5.74,8.65 6.94,9.85 v6.94,10.46 7.59,11.11 9.72,11.11 10.94,12.34 11.79,12.34 VSYS.TP
  Bottom 0.813: J1.5 9.19,20.74 J1.4
  Bottom 1.27: 9.19,20.74 5.52,20.74
  other vias: 4.99,22.69 5.79,22.69 5.39,21.89 6.59,22.69 4.99,21.19 5.89,21.09 6.69,21.09 6.29,20.29 5.89,19.59 4.99,19.59 5.34,20.38
  pour Bottom (isolate 0.254): 4.79,22.89 4.79,19.39 6.79,19.39 6.79,22.89
  pour Top (isolate 0.254): 4.79,22.89 4.79,19.26 6.79,19.26 6.79,22.89